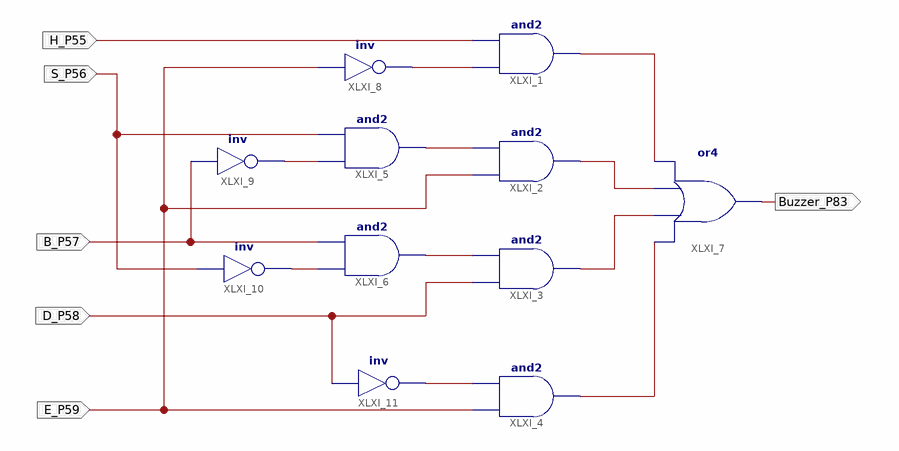
[diagram p0: schematic sheet 1]
// Xilinx ISE schematic Lab04sem.sch (spartan6) as structural Verilog: 11 symbols, 6 ports
module Lab04sem (
  input  H_P55,
  input  S_P56,
  input  B_P57,
  input  D_P58,
  input  E_P59,
  output Buzzer_P83
);

  wire XLXN_1, XLXN_2, XLXN_3, XLXN_4, XLXN_5, XLXN_6, XLXN_7, XLXN_8, XLXN_9, XLXN_10;

  and XLXI_1 (XLXN_3, XLXN_1, H_P55);
  and XLXI_2 (XLXN_4, E_P59, XLXN_2);
  and XLXI_3 (XLXN_5, D_P58, XLXN_8);
  and XLXI_4 (XLXN_6, E_P59, XLXN_7);
  and XLXI_5 (XLXN_2, XLXN_9, S_P56);
  and XLXI_6 (XLXN_8, XLXN_10, B_P57);
  or XLXI_7 (Buzzer_P83, XLXN_6, XLXN_5, XLXN_4, XLXN_3);
  not XLXI_8 (XLXN_1, E_P59);
  not XLXI_9 (XLXN_9, B_P57);
  not XLXI_10 (XLXN_10, S_P56);
  not XLXI_11 (XLXN_7, D_P58);
endmodule
